# Altium project LimeSDR-X3_1v2.PrjPcb (part 10 of 20)

## Sheet 19_FPGA_misc.SchDoc: FPGA misc (PCIe, config)
size A3; Organization: Lime Microsystems; Address1: Surrey Tech Centre; Address2: Guildford GU2 7YG; Address3: Surrey; Address4: United Kingdom; Revision: 1.2; SheetNumber: 19; SheetTotal: 31
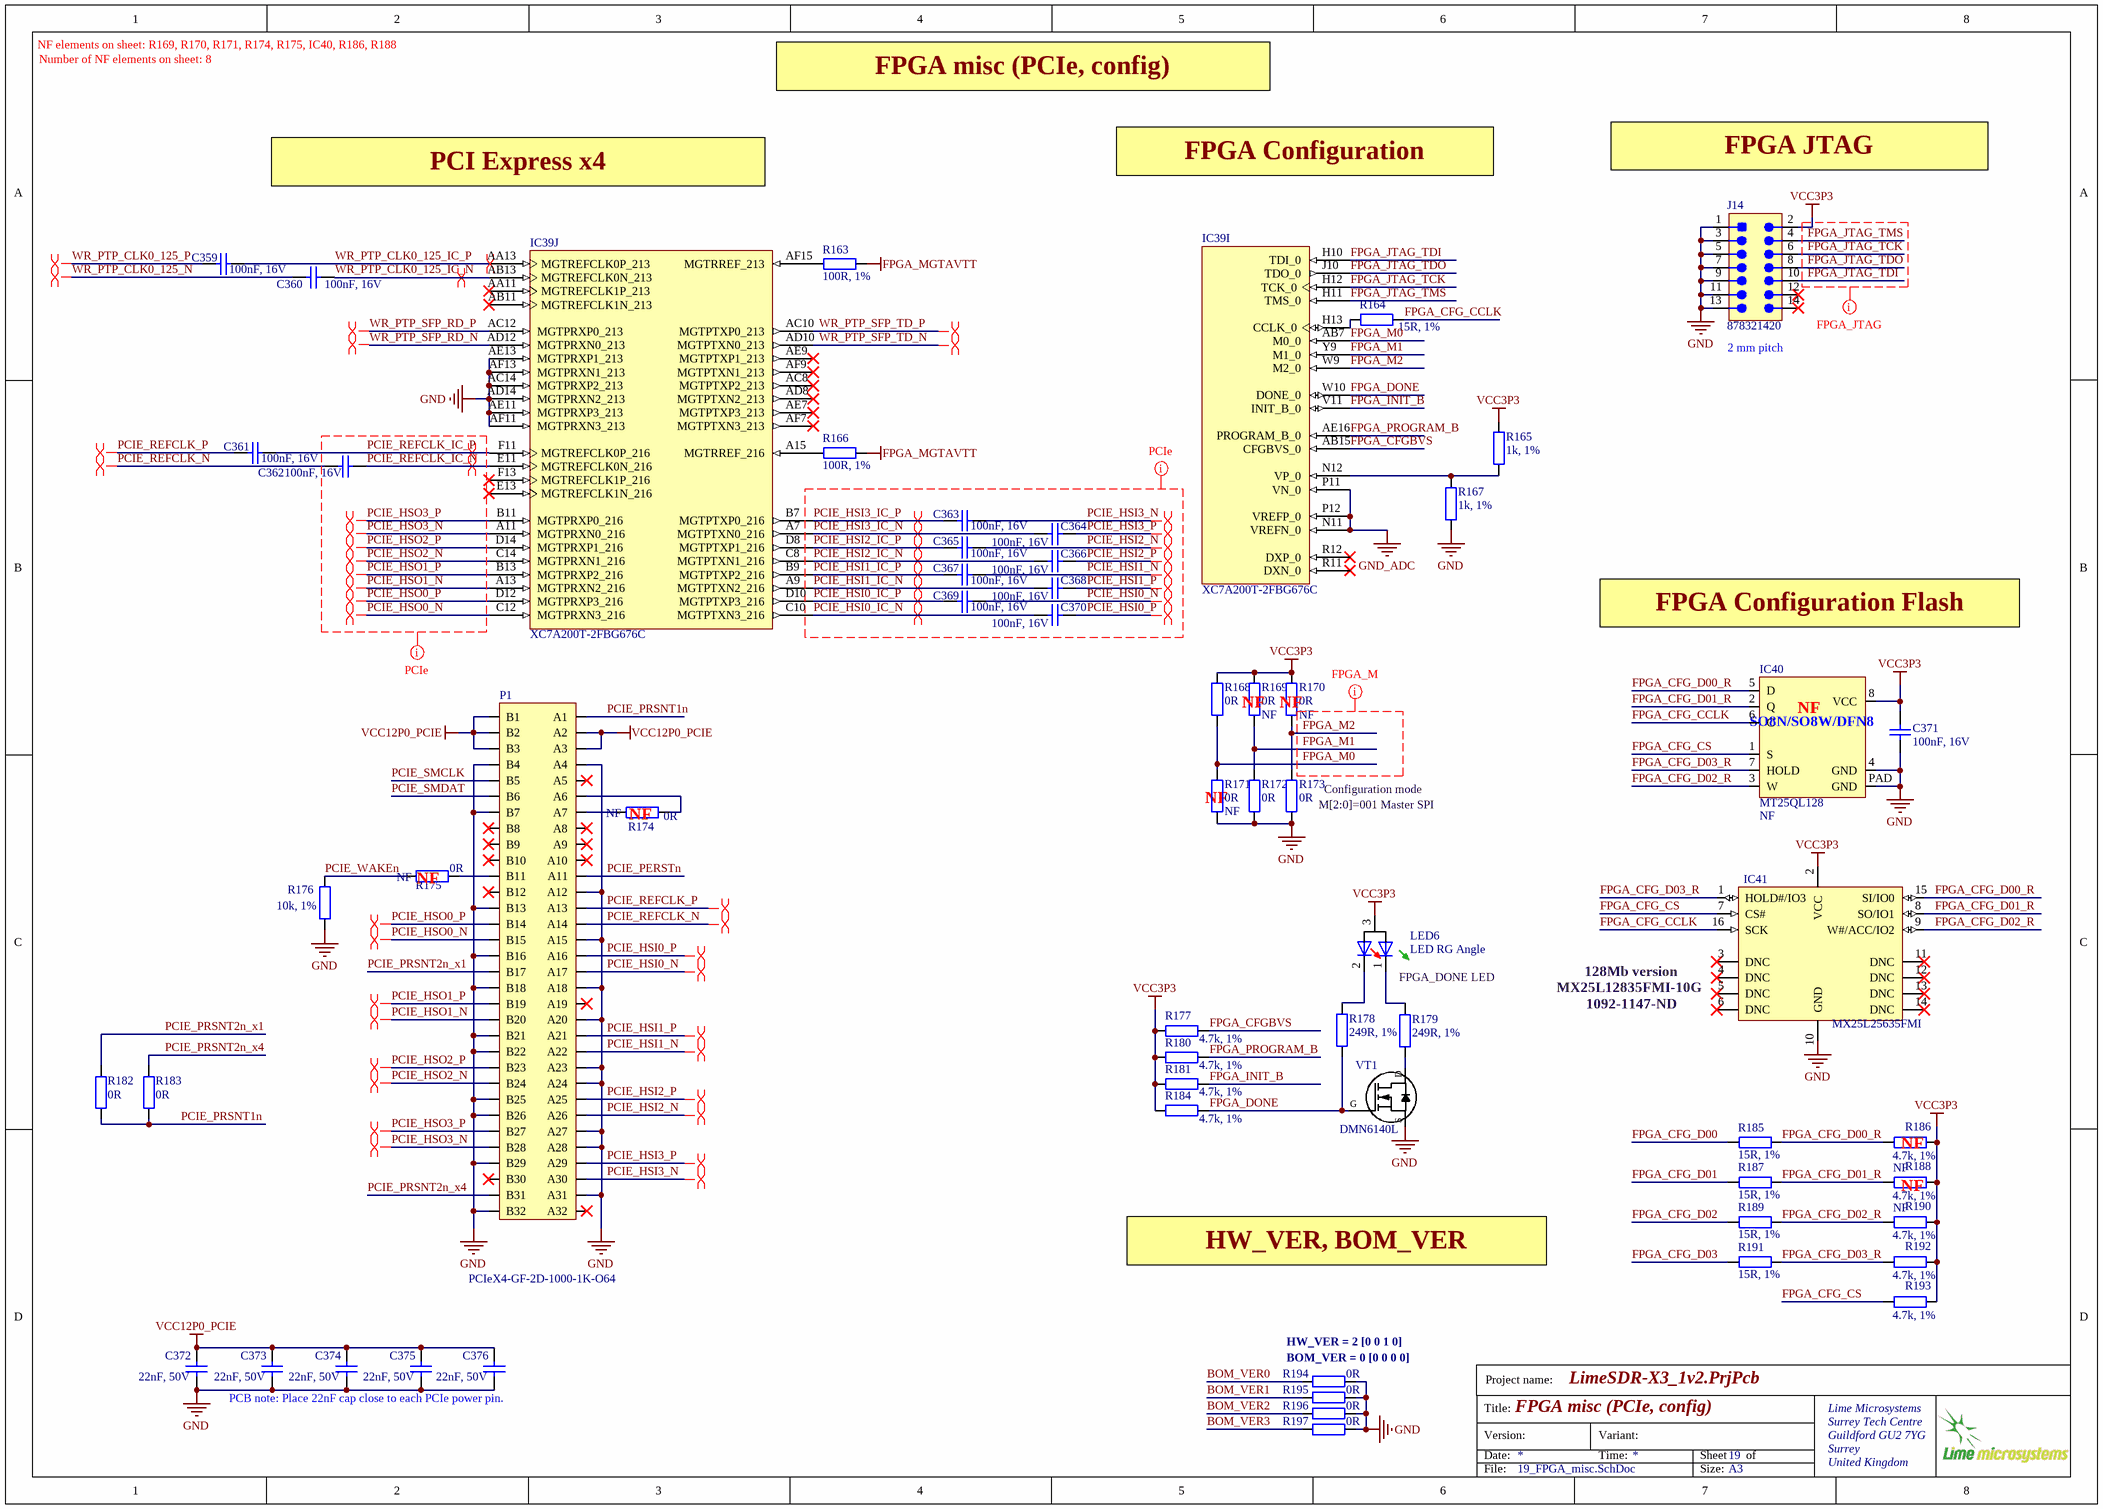
[diagram p18: 19_FPGA_misc.SchDoc]

### Parts
C359  100nF, 16V  [CAP0402]
C360  100nF, 16V  [CAP0402]
C361  100nF, 16V  [CAP0402]
C362  100nF, 16V  [CAP0402]
C363  100nF, 16V  [CAP0402]
C364  100nF, 16V  [CAP0402]
C365  100nF, 16V  [CAP0402]
C366  100nF, 16V  [CAP0402]
C367  100nF, 16V  [CAP0402]
C368  100nF, 16V  [CAP0402]
C369  100nF, 16V  [CAP0402]
C370  100nF, 16V  [CAP0402]
C371  100nF, 16V  [CAP0402]
C372  22nF, 50V  [CAP0402]
C373  22nF, 50V  [CAP0402]
C374  22nF, 50V  [CAP0402]
C375  22nF, 50V  [CAP0402]
C376  22nF, 50V  [CAP0402]
IC39  XC7A200T-2FBG676C  [XC7A200T-2FBG676C_FBG676]  (parts I,J of 14)
IC40  MT25QL128  Assembly Info: NF  [S25FL164K_WSON8_DFN6]
IC41  MX25L25635FMI  [SOIC16_WIDE]
J14  878321420  [MOLEX-878321420_V]
LED6  LED RG Angle  [LED_RG_RIGHT_ANGLE_v3]
P1  PCIeX4-GF-2D-1000-1K-O64  [PCIeX4-GF-2D-1000-1K-O64]  (no BOM)
R163  100R, 1%  [RES0402]
R164  15R, 1%  [RES0402]
R165  1k, 1%  [RES0402]
R166  100R, 1%  [RES0402]
R167  1k, 1%  [RES0402]
R168  0R  [RES0402]
R169  0R  Assembly Info: NF  [RES0402]
R170  0R  Assembly Info: NF  [RES0402]
R171  0R  Assembly Info: NF  [RES0402]
R172  0R  [RES0402]
R173  0R  [RES0402]
R174  0R  Assembly Info: NF  [RES0402]
R175  0R  Assembly Info: NF  [RES0402]
R176  10k, 1%  [RES0402]
R177  4.7k, 1%  [RES0402]
R178  249R, 1%  [RES0402]
R179  249R, 1%  [RES0402]
R180  4.7k, 1%  [RES0402]
R181  4.7k, 1%  [RES0402]
R182  0R  [RES0402]
R183  0R  [RES0402]
R184  4.7k, 1%  [RES0402]
R185  15R, 1%  [RES0402]
R186  4.7k, 1%  Assembly Info: NF  [RES0402]
R187  15R, 1%  [RES0402]
R188  4.7k, 1%  Assembly Info: NF  [RES0402]
R189  15R, 1%  [RES0402]
R190  4.7k, 1%  [RES0402]
R191  15R, 1%  [RES0402]
R192  4.7k, 1%  [RES0402]
R193  4.7k, 1%  [RES0402]
R194  0R  [RES0402]
R195  0R  [RES0402]
R196  0R  [RES0402]
R197  0R  [RES0402]
VT1  DMN6140L  [SOT23-3]

### Nets
FPGA_MGTAVTT: R163.2 R166.2
GND: C371.2 C372.2 C373.2 C374.2 C375.2 C376.2 IC39.AC14(MGTPRXP2_213) IC39.AD14(MGTPRXN2_213) IC39.AE11(MGTPRXP3_213) IC39.AE13(MGTPRXP1_213) IC39.AF11(MGTPRXN3_213) IC39.AF13(MGTPRXN1_213) IC40.4(GND) IC40.PAD(GND) IC41.10(GND) J14.1 J14.3 J14.5 J14.7 J14.9 J14.11 J14.13 P1.A4 P1.A12 P1.A15 P1.A18 P1.A20 P1.A23 P1.A24 P1.A27 P1.A28 P1.A31 P1.B4 P1.B7 P1.B13 P1.B16 P1.B18 P1.B21 P1.B22 P1.B25 P1.B26 P1.B29 P1.B32 R167.1 R171.2 R172.2 R173.2 R176.2 R194.2 R195.2 R196.2 R197.2 VT1.S
GND_ADC: IC39.N11(VREFN_0) IC39.P11(VN_0) IC39.P12(VREFP_0)
VCC3P3: C371.1 IC40.8(VCC) IC41.2(VCC) J14.2 LED6.3(A) R165.1 R168.1 R169.1 R170.1 R177.1 R180.1 R181.1 R184.1 R186.1 R188.1 R190.1 R192.1 R193.1
VCC12P0_PCIE: C372.1 C373.1 C374.1 C375.1 C376.1 P1.A2 P1.A3 P1.B1 P1.B2 P1.B3
BOM_VER0: R194.1
BOM_VER1: R195.1
BOM_VER2: R196.1
BOM_VER3: R197.1
FPGA_CFG_CCLK: IC40.6(C) IC41.16(SCK) R164.2
FPGA_CFG_CS: IC40.1(S) IC41.7(CS#) R193.2
FPGA_CFG_D00: R185.2
FPGA_CFG_D00_R: IC40.5(D) IC41.15(SI/IO0) R185.1 R186.2
FPGA_CFG_D01: R187.2
FPGA_CFG_D01_R: IC40.2(Q) IC41.8(SO/IO1) R187.1 R188.2
FPGA_CFG_D02: R189.2
FPGA_CFG_D02_R: IC40.3(W) IC41.9(W#/ACC/IO2) R189.1 R190.2
FPGA_CFG_D03: R191.2
FPGA_CFG_D03_R: IC40.7(HOLD) IC41.1(HOLD#/IO3) R191.1 R192.2
FPGA_CFGBVS: IC39.AB15(CFGBVS_0) R177.2
FPGA_DONE: IC39.W10(DONE_0) R178.1 R184.2 VT1.G
FPGA_INIT_B: IC39.V11(INIT_B_0) R181.2
FPGA_JTAG_TCK: IC39.H12(TCK_0) J14.6
FPGA_JTAG_TDI: IC39.H10(TDI_0) J14.10
FPGA_JTAG_TDO: IC39.J10(TDO_0) J14.8
FPGA_JTAG_TMS: IC39.H11(TMS_0) J14.4
FPGA_M0: IC39.AB7(M0_0) R168.2 R171.1
FPGA_M1: IC39.Y9(M1_0) R169.2 R172.1
FPGA_M2: IC39.W9(M2_0) R170.2 R173.1
FPGA_PROGRAM_B: IC39.AE16(PROGRAM_B_0) R180.2
PCIE_HSI0_IC_N: C370.2 IC39.C10(MGTPTXN3_216)
PCIE_HSI0_IC_P: C369.2 IC39.D10(MGTPTXP3_216)
PCIE_HSI0_N: C369.1 P1.A17
PCIE_HSI0_P: C370.1 P1.A16
PCIE_HSI1_IC_N: C368.2 IC39.A9(MGTPTXN2_216)
PCIE_HSI1_IC_P: C367.2 IC39.B9(MGTPTXP2_216)
PCIE_HSI1_N: C367.1 P1.A22
PCIE_HSI1_P: C368.1 P1.A21
PCIE_HSI2_IC_N: C366.2 IC39.C8(MGTPTXN1_216)
PCIE_HSI2_IC_P: C365.2 IC39.D8(MGTPTXP1_216)
PCIE_HSI2_N: C365.1 P1.A26
PCIE_HSI2_P: C366.1 P1.A25
PCIE_HSI3_IC_N: C364.2 IC39.A7(MGTPTXN0_216)
PCIE_HSI3_IC_P: C363.2 IC39.B7(MGTPTXP0_216)
PCIE_HSI3_N: C363.1 P1.A30
PCIE_HSI3_P: C364.1 P1.A29
PCIE_HSO0_N: IC39.C12(MGTPRXN3_216) P1.B15
PCIE_HSO0_P: IC39.D12(MGTPRXP3_216) P1.B14
PCIE_HSO1_N: IC39.A13(MGTPRXN2_216) P1.B20
PCIE_HSO1_P: IC39.B13(MGTPRXP2_216) P1.B19
PCIE_HSO2_N: IC39.C14(MGTPRXN1_216) P1.B24
PCIE_HSO2_P: IC39.D14(MGTPRXP1_216) P1.B23
PCIE_HSO3_N: IC39.A11(MGTPRXN0_216) P1.B28
PCIE_HSO3_P: IC39.B11(MGTPRXP0_216) P1.B27
PCIE_PERSTn: P1.A11
PCIE_PRSNT1n: P1.A1 R182.1 R183.1
PCIE_PRSNT2n_x1: P1.B17 R182.2
PCIE_PRSNT2n_x4: P1.B31 R183.2
PCIE_REFCLK_IC_N: C362.1 IC39.E11(MGTREFCLK0N_216)
PCIE_REFCLK_IC_P: C361.1 IC39.F11(MGTREFCLK0P_216)
PCIE_REFCLK_N: C362.2 P1.A14
PCIE_REFCLK_P: C361.2 P1.A13
PCIE_SMCLK: P1.B5
PCIE_SMDAT: P1.B6
PCIE_WAKEn: R175.1 R176.1
WR_PTP_CLK0_125_IC_N: C360.1 IC39.AB13(MGTREFCLK0N_213)
WR_PTP_CLK0_125_IC_P: C359.1 IC39.AA13(MGTREFCLK0P_213)
WR_PTP_CLK0_125_N: C360.2
WR_PTP_CLK0_125_P: C359.2
WR_PTP_SFP_RD_N: IC39.AD12(MGTPRXN0_213)
WR_PTP_SFP_RD_P: IC39.AC12(MGTPRXP0_213)
WR_PTP_SFP_TD_N: IC39.AD10(MGTPTXN0_213)
WR_PTP_SFP_TD_P: IC39.AC10(MGTPTXP0_213)
NetIC39_A15: IC39.A15(MGTRREF_216) R166.1
NetIC39_AF15: IC39.AF15(MGTRREF_213) R163.1
NetIC39_H13: IC39.H13(CCLK_0) R164.1
NetIC39_N12: IC39.N12(VP_0) R165.2 R167.2
NetLED6_1: LED6.1(C1) R179.2
NetLED6_2: LED6.2(C2) R178.2
NetP1_A6: P1.A6 R174.2
NetP1_A7: P1.A7 R174.1
NetP1_B11: P1.B11 R175.2
NetR179_1: R179.1 VT1.D

Not connected (* = marked no-connect by the designer): IC39 AA11(MGTREFCLK1P_213)* AB11(MGTREFCLK1N_213)* AC8(MGTPTXP2_213)* AD8(MGTPTXN2_213)* AE7(MGTPTXP3_213)* AE9(MGTPTXP1_213)* AF7(MGTPTXN3_213)* AF9(MGTPTXN1_213)* E13(MGTREFCLK1N_216)* F13(MGTREFCLK1P_216)* R11(DXN_0)* R12(DXP_0)*; IC41 3(DNC)* 4(DNC)* 5(DNC)* 6(DNC)* 11(DNC)* 12(DNC)* 13(DNC)* 14(DNC)*; J14 12* 14*; P1 A5* A8* A9* A10* A19* A32* B8* B9* B10* B12* B30*

### Layout directives
differential pair: PCIE_HSI0_IC_N, PCIE_HSI0_IC_P, PCIE_HSI0_N, PCIE_HSI0_P, PCIE_HSI1_IC_N, PCIE_HSI1_IC_P, PCIE_HSI1_N, PCIE_HSI1_P, PCIE_HSI2_IC_N, PCIE_HSI2_IC_P, PCIE_HSI2_N, PCIE_HSI2_P, PCIE_HSI3_IC_N, PCIE_HSI3_IC_P, PCIE_HSI3_N, PCIE_HSI3_P, PCIE_HSO0_N, PCIE_HSO0_P, PCIE_HSO1_N, PCIE_HSO1_P, PCIE_HSO2_N, PCIE_HSO2_P, PCIE_HSO3_N, PCIE_HSO3_P, PCIE_REFCLK_IC_N, PCIE_REFCLK_IC_P, PCIE_REFCLK_N, PCIE_REFCLK_P, WR_PTP_CLK0_125_IC_N, WR_PTP_CLK0_125_IC_P, WR_PTP_CLK0_125_N, WR_PTP_CLK0_125_P, WR_PTP_SFP_RD_N, WR_PTP_SFP_RD_P, WR_PTP_SFP_TD_N, WR_PTP_SFP_TD_P
net class FPGA_JTAG: FPGA_JTAG_TCK, FPGA_JTAG_TDI, FPGA_JTAG_TDO, FPGA_JTAG_TMS
net class FPGA_M: FPGA_M0, FPGA_M1, FPGA_M2
net class PCIe: PCIE_HSI0_IC_N, PCIE_HSI0_IC_P, PCIE_HSI0_N, PCIE_HSI0_P, PCIE_HSI1_IC_N, PCIE_HSI1_IC_P, PCIE_HSI1_N, PCIE_HSI1_P, PCIE_HSI2_IC_N, PCIE_HSI2_IC_P, PCIE_HSI2_N, PCIE_HSI2_P, PCIE_HSI3_IC_N, PCIE_HSI3_IC_P, PCIE_HSI3_N, PCIE_HSI3_P, PCIE_HSO0_N, PCIE_HSO0_P, PCIE_HSO1_N, PCIE_HSO1_P, PCIE_HSO2_N, PCIE_HSO2_P, PCIE_HSO3_N, PCIE_HSO3_P, PCIE_REFCLK_IC_N, PCIE_REFCLK_IC_P

### Notes on the sheet
- NF elements on sheet: R169, R170, R171, R174, R175, IC40, R186, R188
- Number of NF elements on sheet: 8
- FPGA misc (PCIe, config)
- PCI Express x4
- FPGA Configuration
- FPGA JTAG
- (near J14) 2 mm pitch
- FPGA Configuration Flash
- (near R169) NF
- (near R170) NF
- (near IC40) NF
- (near R174) NF
- (near R171) NF
- (near R173) M[2:0]=001 Master SPI
- (near R173) Configuration mode
- (near R175) NF
- FPGA_DONE LED
- (near IC41) 128Mb version
  MX25L12835FMI-10G
  1092-1147-ND
- (near R186) NF
- (near R188) NF
- HW_VER, BOM_VER
- (near R194) BOM_VER = 0 [0 0 0 0]
- HW_VER = 2 [0 0 1 0]
- PCB note: Place 22nF cap close to each PCIe power pin.
- Project name:
- Title:
- Version:
- Date:
- Variant:
- Time:
- Sheet
- of
- File:
- Size:
- A3
- (in symbol M25P40_with_pad) SO8N/SO8W/DFN8

### Library data of the parts
C359-C370 = Cap_0603: Part Description: 0.10µF ±10% 16V X7R Ceramic Capacitor -55°C ~ 125°C Surface Mount, MLCC 0402 (1005 Metric) 0.039" L x 0.020" W (1.00mm x 0.50mm); Manufacturer Part Number 1: GRM155R71C104KA88D; Brand: Murata Electronics; Tolerance: 10 %; Type: General Purpose MLCC; Capacitance: 0.1 uF; Temperature Coefficient / Code: +/- 15 %; Case Height: 0.5 mm; Case Length: 1 mm; Dielectric: X7R; Supplier 1: Mouser; Supplier Part Number 1: 81-GRM155R71C104KA88; Case Code - in: 0402; Manufacturer: Murata Electronics; Category: Multilayer Ceramic Capacitors MLCC - SMD/SMT; Voltage Rating DC: 16 V; Value: 100nF, 16V; Case Code - mm: 1005; Case Width: 0.5 mm; Maximum Operating Temperature: + 125 C; Minimum Operating Temperature: - 55 C; Minimum Order Quantity: 1; Operating Temperature Range: - 55 C to + 125 C; Package / Case: 0402 (1005 metric); Packaging: Reel; Product: General Type MLCCs; Product Category: Low & Medium Capacitance SMD Ceramic Chip Capacitors; Reeling: True; RoHS - Mouser: Y; RoHS: RoHS Compliant; Series: GRM; Standard Pack Qty: 10000; Termination Style: SMD/SMT
C371 = Cap_0603: Manufacturer Part Number 1: GRM155R71C104KA88D; Part Description: 0.10µF ±10% 16V X7R Ceramic Capacitor -55°C ~ 125°C Surface Mount, MLCC 0402 (1005 Metric) 0.039" L x 0.020" W (1.00mm x 0.50mm); Brand: Murata Electronics; Tolerance: 10 %; Type: General Purpose MLCC; Capacitance: 0.1 uF; Temperature Coefficient / Code: +/- 15 %; Case Height: 0.5 mm; Case Length: 1 mm; Dielectric: X7R; Supplier 1: Mouser; Supplier Part Number 1: 81-GRM155R71C104KA88; Case Code - in: 0402; Manufacturer: Murata Electronics; Category: Multilayer Ceramic Capacitors MLCC - SMD/SMT; Voltage Rating DC: 16 V; Value: 100nF, 16V; Case Code - mm: 1005; Case Width: 0.5 mm; Maximum Operating Temperature: + 125 C; Minimum Operating Temperature: - 55 C; Minimum Order Quantity: 1; Operating Temperature Range: - 55 C to + 125 C; Package / Case: 0402 (1005 metric); Packaging: Reel; Product: General Type MLCCs; Product Category: Low & Medium Capacitance SMD Ceramic Chip Capacitors; Reeling: True; RoHS - Mouser: Y; RoHS: RoHS Compliant; Series: GRM; Standard Pack Qty: 10000; Termination Style: SMD/SMT
C372-C376 = Cap_0402: Manufacturer: Kemet; Manufacturer Part Number 1: C0402C223K5RACTU; Part Description: 0.022µF ±10% 50V Ceramic Capacitor X7R 0402 (1005 Metric); Temperature Coefficient: X7R; Tolerance: ±10%; Capacitance: 0.022µF; Value: 22nF, 50V; Supplier 1: Digi-Key; Supplier Part Number 1: 399-7780-1-ND; Ratings: -; Packaging: Cut Tape (CT); Category: Capacitors; Size / Dimension: 0.039" L x 0.020" W (1.00mm x 0.50mm); RoHS: RoHS Compliant; Operating Temperature: -55°C ~ 125°C; Mounting Type: Surface Mount, MLCC; Applications: General Purpose; Voltage - Rated: 50V; Thickness (Max): 0.022" (0.55mm); Features: -; Height - Seated (Max): -; Lead Style: -; Package / Case: 0402 (1005 Metric); Lead Spacing: -
IC39 = XC7A200T-2FBG676C: Artix-7 FPGA, 400 User I/Os, 8 GTP, 676-Ball BGA, Speed Grade 2, Commercial Grade, Pb-Free; Manufacturer: Xilinx; Part Description: IC FPGA 400 I/O 676FCBGA; Speed Grade: -2; Number of Logic Blocks (LABs): 16825; Number of Logic Elements/Cells: 215360; RAM Size: 13455360b; Number of I/Os: 400; Number of Registers: 269200; Memory Type: DDR3; Memory Size: 1GB; Max Supply Voltage: 1.05V; Min Supply Voltage: 950mV; ComponentLink1Description: Manufacturer URL; ComponentLink1URL: http://www.xilinx.com/; ComponentLink2Description: Datasheet; ComponentLink2URL: http://www.xilinx.com/support/documentation/data_sheets/ds180_7Series_Overview.pdf; ComponentLink3Description: Package Specification; ComponentLink3URL: http://www.xilinx.com/support/documentation/user_guides/ug475_7Series_Pkg_Pinout.pdf; ComponentLink4Description: DC and Switching Characteristics; ComponentLink4URL: http://www.xilinx.com/support/documentation/data_sheets/ds181_Artix_7_Data_Sheet.pdf; ComponentLink5Description: Package File; ComponentLink5URL: http://www.xilinx.com/support/packagefiles/a7packages/xc7a200tfbg676pkg.txt; ComponentLink6Description: Packaging and Pinout; ComponentLink6URL: http://www.xilinx.com/support/documentation/user_guides/ug475_7Series_Pkg_Pinout.pdf; Supplier 1: Digi-Key; Supplier Part Number 1: 122-1865-ND; Manufacturer Part Number 1: XC7A200T-2FBG676C; Stock 1: 124; Pricing 1: 1=261,30000 (USD); RoHS: Yes; Case/Package: FCBGA; Number of Pins: 676; Contact Plating: Copper,Tin,Silver; Min Operating Temperature: 0°C; Max Operating Temperature: 85°C; ComponentLink7URL: https://datasheet.ciiva.com/15066/ds181-artix-7-data-sheet-15066344.pdf?src-supplier=Digi-Key; ComponentLink7Description: https://datasheet.ciiva.com/15066/ds181-artix-7-data-sheet-15066344.pdf?src-supplier=Digi-Key; ComponentLink8URL: https://datasheet.ciiva.com/48475/ds180-7series-overview-48475947.pdf?src-supplier=Avnet; ComponentLink8Description: https://datasheet.ciiva.com/48475/ds180-7series-overview-48475947.pdf?src-supplier=Avnet
IC40 = M25P40_with_pad: Manufacturer: Micron Technology; Manufacturer Part Number 1: MT25QL128ABA1ESE-0SITTR; Part Description: FLASH - NOR Memory IC 128Mb (16M x 8) SPI 133MHz  8-SO; Frequency: 133MHz; Memory Size: 128Mb; Memory Type: Non-Volatile,FLASH; Case/Package: SOIC; Max Operating Temperature: 85°C; Min Operating Temperature: -40°C; Mount: Surface Mount; Number of Pins: 8; Packaging: Tape and Reel; Pricing 1: 1=2.67, 10=2.401, 25=2.3632, 50=2.357, 100=2.1061, 250=2.03764, 500=2.03006 (USD); Stock 1: 4313; Supplier 1: Digi-Key; Supplier Part Number 1: 557-1772-1-ND; Value: MT25QL128
IC41 = S25FL032P: Manufacturer: Macronix; Manufacturer Part Number 1: MX25L25635FMI-10G; Part Description: FLASH - NOR Memory IC 256Mb (32M x 8) SPI 104MHz  16-SOP; Operating Supply Voltage: 3.6V; Interface: SPI,Serial; Memory Type: FLASH,NOR; Frequency: 104MHz; Density: 256Mb; Supplier 1: Digi-Key; Supplier Part Number 1: 1092-1149-ND; Stock 1: 19945; Pricing 1: 1=4.09, 528=3.11068 (USD); Case/Package: SOIC; Number of Pins: 16; Min Operating Temperature: -40°C; Max Operating Temperature: 85°C; Package Quantity: 44; Packaging: Rail/Tube; Max Frequency: 104MHz; Lead Free: Lead Free; Value: MX25L25635FMI
J14 = MOLEX_CONNECTOR_0878321420: Male Header, Pitch 2 mm, 2 x 7 Position, Height 7.6 mm, -55 to 105 degC, RoHS; Part Description: Connector Header Surface Mount 14 position 0.079" (2.00mm); Manufacturer: Molex; Manufacturer Part Number 1: 87832-1420; Number of Positions: 14; Current Rating: 2A; Insulation Resistance: 1GR; Voltage Rating: 125V; Shrouded: Yes (With); Pitch: 2mm; Glow Wire Compliant: Non-compliant; Supplier 1: Digi-Key; Stock 1: 62479; Pricing 1: 1 = 1,83000, 10 = 1,66000, 100 = 1,42280, 500 = 1,18562, 3200 = 0,94850, 6400 = 0,90108 (USD); RoHS: Yes; Mount: Surface Mount; Color: Black; Housing Color: Black; Housing Material: Thermoplastic; Contact Plating: Gold; Contact Material: Brass; Min Operating Temperature: -55°C; Max Operating Temperature: 105°C; Number of Rows: 2; Packaging: Rail/Tube; Termination: SMD/SMT; Number of Contacts: 14; Orientation: Vertical; Gender: Male; Package Quantity: 3200; Number of Circuits: 14; Voltage Rating (DC): 125V; Radiation Hardening: No; REACH SVHC: No SVHC; Lead Free: Lead Free; Flammability Rating: UL94 V-0; ComponentLink1URL: https://datasheet.ciiva.com/5151/0878321420-pcb-headers-176595-5151942.pdf?src-supplier=Mouser; ComponentLink1Description: https://datasheet.ciiva.com/5151/0878321420-pcb-headers-176595-5151942.pdf?src-supplier=Mouser; ComponentLink2URL: https://datasheet.ciiva.com/30118/0878321420-pcb-headers-30118102.pdf?src-supplier=Onlinecomponents.com; ComponentLink2Description: https://datasheet.ciiva.com/30118/0878321420-pcb-headers-30118102.pdf?src-supplier=Onlinecomponents.com; ComponentLink3URL: https://datasheet.ciiva.com/11746/0900766b80d68d6a-11746394.pdf?src-supplier=RSComponents; ComponentLink3Description: https://datasheet.ciiva.com/11746/0900766b80d68d6a-11746394.pdf?src-supplier=RSComponents; ComponentLink4URL: https://datasheet.ciiva.com/7814/1625645-7814923.pdf?src-supplier=Element14; ComponentLink4Description: https://datasheet.ciiva.com/7814/1625645-7814923.pdf?src-supplier=Element14; ComponentLink5URL: https://datasheet.ciiva.com/27055/1934622-27055085.pdf?src-supplier=Jameco; ComponentLink5Description: https://datasheet.ciiva.com/27055/1934622-27055085.pdf?src-supplier=Jameco; ComponentLink6URL: https://datasheet.ciiva.com/1103/1739253-1103569.pdf?src-supplier=Element14; ComponentLink6Description: https://datasheet.ciiva.com/1103/1739253-1103569.pdf?src-supplier=Element14; ComponentLink7URL: https://datasheet.ciiva.com/18453/70090647-18453733.pdf?src-supplier=Allied+Electronics; ComponentLink7Description: https://datasheet.ciiva.com/18453/70090647-18453733.pdf?src-supplier=Allied+Electronics; ComponentLink8URL: https://datasheet.ciiva.com/6168/1597333-6168907.pdf?src-supplier=Farnell; ComponentLink8Description: https://datasheet.ciiva.com/6168/1597333-6168907.pdf?src-supplier=Farnell; Supplier Part Number 1: WM18641-ND
LED6 = LED_green_red_right_angle_v2: Part Description: Green, Red 572nm Green, 647nm Red LED Indication - Discrete 2.1V Green, 1.7V Red 2-SMD, No Lead; Manufacturer: Stanley Electric; Manufacturer Part Number 1: BRPY1211FTR; Color: Green,Red; Lens Color: White; Viewing Angle: 143°; Forward Voltage: 1.7V; Lens Style: Colorless; Wavelength: 570nm; Reverse Breakdown Voltage: 4V; Forward Current: 25mA; Dominant Wavelength: 647nm; Luminous Intensity: 17.6mcd; Test Current: 20mA; Lens Transparency: Diffused; Number of Elements: 2; Power Dissipation: 70mW; Supplier 1: Arrow Electronics; Supplier Part Number 1: BRPY1211F-TR; Stock 1: 0; RoHS: Yes; Mount: Surface Mount; Case/Package: SMD/SMT; Number of Pins: 3; Min Operating Temperature: -40°C; Max Operating Temperature: 85°C; Packaging: Tape and Reel; Package Quantity: 3000; Reverse Voltage: 4V; Length: 3mm; Width: 2mm; Height: 1.15mm; Depth: 2mm; Radiation Hardening: No; Lead Free: Lead Free; ComponentLink1URL: https://datasheet.ciiva.com/2114/1211f-e-2114386.pdf?src-supplier=Digi-Key; ComponentLink1Description: https://datasheet.ciiva.com/2114/1211f-e-2114386.pdf?src-supplier=Digi-Key
R163 R166 = Res_0402: Manufacturer Part Number 1: RMCF0402FT100R; Part Description: RES SMD 100 OHM 1% 1/16W 0402; Manufacturer: Stackpole Electronics Inc.; Temperature Coefficient: ±100ppm/°C; Supplier 1: Digi-Key; Supplier Part Number 1: RMCF0402FT100RDKR-ND; Package / Case: 0402 (1005 Metric); Composition: Thick Film; Category: Resistors; Tolerance: ±1%; Value: 100R, 1%
R164 = Res_0402: Manufacturer: Yageo; Manufacturer Part Number 1: RC0402FR-0715RL; Part Description: 15 Ohms ±1% 0.063W, 1/16W Chip Resistor 0402 (1005 Metric) Moisture Resistant Thick Film; Max Power Dissipation: 63mW; Temperature Coefficient: 100ppm/°C; Voltage Rating: 50V; ComponentLink1URL: http://www.farnell.com/datasheets/1018594.pdf?src-supplier=Element14; ComponentLink1Description: http://www.farnell.com/datasheets/1018594.pdf?src-supplier=Element14; ComponentLink2URL: https://www.verical.com/server-webapp/html/getDatasheet?partID=323697&src-supplier=Verical; ComponentLink2Description: https://www.verical.com/server-webapp/html/getDatasheet?partID=323697&src-supplier=Verical; Value: 15R, 1%; Case/Package: 0402; Case Code (Imperial): 0402; Case Code (Metric): 1005; ComponentLink3Description: http://www.yageo.com/documents/recent/PYu-RC0402_51_RoHS_L_6_r.pdf?src-supplier=Future+Electronics; ComponentLink3URL: http://www.yageo.com/documents/recent/PYu-RC0402_51_RoHS_L_6_r.pdf?src-supplier=Future+Electronics; ComponentLink4Description: http://www.yageo.com/documents/recent/PYu-RC0402_51_RoHS_L_6_r.pdf?src-supplier=Mouser; ComponentLink4URL: http://www.yageo.com/documents/recent/PYu-RC0402_51_RoHS_L_6_r.pdf?src-supplier=Mouser; Composition: Thick Film; Depth: 0.5mm; Features: Moisture Resistant; Height: 0.016inch; Lead Free: Lead Free; Length: 1mm; Max Operating Temperature: 155°C; Military Standard: Not; Min Operating Temperature: -55°C; Number of Terminations: 2; Package Quantity: 1; Packaging: Tape and Reel; Power Rating: 63mW; Pricing 1: 1=0.1, 10=0.016, 100=0.0067, 1000=0.00301, 2500=0.00261, 5000=0.00215 (USD); REACH SVHC: Unknown; Resistance: 15R; Stock 1: 1902799; Supplier 1: Digi-Key; Supplier Part Number 1: 311-15LRCT-ND; Termination: SMD/SMT; Tolerance: 1%; Width: 0.02inch
R165 R167 = Res_0402: Manufacturer: Stackpole Electronics Inc; Manufacturer Part Number 1: RMCF0402FT1K00; Part Description: RES SMD 1K OHM 1% 1/16W 0402; Temperature Coefficient: ±100ppm/°C; Power (Watts): 0.063W, 1/16W; Value: 1k, 1%; Supplier 1: Digi-Key; Supplier Part Number 1: RMCF0402FT1K00TR-ND; Resistance (Ohms): 1k; Packaging: Tape & Reel (TR); Category: Resistors; RoHS: RoHS Compliant; Tolerance: ±1%; Height: 0.016" (0.40mm); Number of Terminations: 2; Package / Case: 0402 (1005 Metric); Operating Temperature: -55°C ~ 155°C; Features: -; Composition: Thick Film; Supplier Device Package: 0402; Size / Dimension: 0.039" L x 0.020" W (1.00mm x 0.50mm)
R168-R173 = Res_0402: Manufacturer Part Number 1: RC0402JR-070RL; Manufacturer: Yageo; Part Description: RES SMD 0.0OHM JUMPER 1/16W 0402; Resistance (Ohms): 0.0; Tolerance: Jumper; Power (Watts): 0.063W, 1/16W; Value: 0R; Supplier 1: Digi-Key; Supplier Part Number 1: 311-0.0JRTR-ND; Category: Resistors; Temperature Coefficient: -; Features: Moisture Resistant; Supplier Device Package: 0402; Height: 0.016" (0.40mm); Package / Case: 0402 (1005 Metric); Operating Temperature: -55°C ~ 155°C; Size / Dimension: 0.039" L x 0.020" W (1.00mm x 0.50mm); Composition: Thick Film; Packaging: Tape & Reel (TR); Number of Terminations: 2; RoHS: RoHS Compliant
R174 R175 R182 R183 R194-R197 = Res_0402: Manufacturer: Yageo; Part Description: RES SMD 0.0OHM JUMPER 1/16W 0402; Manufacturer Part Number 1: RC0402JR-070RL; Supplier 1: Digi-Key; Supplier Part Number 1: 311-0.0JRTR-ND; Composition: Thick Film; Package / Case: 0402 (1005 Metric); Category: Resistors; Value: 0R
R176 = Res_0402: Manufacturer: Yageo; Manufacturer Part Number 1: RC0402FR-0710KL; Part Description: RES SMD 10K OHM 1% 1/16W 0402; Temperature Coefficient: ±100ppm/°C; Power (Watts): 0.063W, 1/16W; Value: 10k, 1%; Supplier 1: Digi-Key; Supplier Part Number 1: 311-10.0KLRTR-ND; Resistance (Ohms): 10k; Packaging: Tape & Reel (TR); RoHS: RoHS Compliant; Package / Case: 0402 (1005 Metric); Tolerance: ±1%; Operating Temperature: -55°C ~ 155°C; Size / Dimension: 0.039" L x 0.020" W (1.00mm x 0.50mm); Number of Terminations: 2; Category: Resistors; Height: 0.016" (0.40mm); Supplier Device Package: 0402; Features: Moisture Resistant; Composition: Thick Film
R177 R180 R181 R184 R186 R188 R190 R192 R193 = Res_0402: Manufacturer: Yageo; Part Description: RES SMD 4.7K OHM 1% 1/16W 0402; Manufacturer Part Number 1: RC0402FR-074K7L; Temperature Coefficient: ±100ppm/°C; Power (Watts): 0.063W, 1/16W; Number of Terminations: 2; Category: Resistors; Supplier 1: Digi-Key; Height: 0.016" (0.40mm); Features: Moisture Resistant; Size / Dimension: 0.039" L x 0.020" W (1.00mm x 0.50mm); Supplier Device Package: 0402; RoHS: RoHS Compliant; Composition: Thick Film; Package / Case: 0402 (1005 Metric); Resistance (Ohms): 4.7k; Operating Temperature: -55°C ~ 155°C; Tolerance: ±1%; Supplier Part Number 1: 311-4.7KLRCT-ND; Packaging: Cut Tape (CT); Value: 4.7k, 1%
R178 R179 = Res_0402: Manufacturer Part Number 1: RMCF0402FT249R; Manufacturer: Stackpole Electronics Inc; Part Description: RES SMD 249 OHM 1% 1/16W 0402; Resistance (Ohms): 249; Power (Watts): 0.063W, 1/16W; Temperature Coefficient: ±100ppm/°C; Value: 249R, 1%; Supplier 1: Digi-Key; Supplier Part Number 1: RMCF0402FT249RCT-ND; Package / Case: 0402 (1005 Metric); Features: -; Size / Dimension: 0.039" L x 0.020" W (1.00mm x 0.50mm); Category: Resistors; Operating Temperature: -55°C ~ 155°C; Packaging: Cut Tape (CT); Tolerance: ±1%; Supplier Device Package: 0402; RoHS: RoHS Compliant; Composition: Thick Film; Number of Terminations: 2; Height: 0.016" (0.40mm)
R185 R187 R189 R191 = Res_0402: Manufacturer: Yageo; Manufacturer Part Number 1: RC0402FR-0715RL; Part Description: 15 Ohms ±1% 0.063W, 1/16W Chip Resistor 0402 (1005 Metric) Moisture Resistant Thick Film; Power Rating: 63mW; Voltage Rating: 50V; Temperature Coefficient: 100ppm/°C; Value: 15R, 1%; Supplier 1: Digi-Key; Supplier Part Number 1: 311-15LRCT-ND; Stock 1: 1902799; Pricing 1: 1=0.1, 10=0.016, 100=0.0067, 1000=0.00301, 2500=0.00261, 5000=0.00215 (USD); Case/Package: 0402; Case Code (Metric): 1005; Case Code (Imperial): 0402; Min Operating Temperature: -55°C; Max Operating Temperature: 155°C; Resistance: 15R; Tolerance: 1%; Packaging: Tape and Reel; Package Quantity: 1; Composition: Thick Film; Number of Terminations: 2; Termination: SMD/SMT; Military Standard: Not; Max Power Dissipation: 63mW; Features: Moisture Resistant; Length: 1mm; Height: 0.016inch; Width: 0.02inch; Depth: 0.5mm; REACH SVHC: Unknown; Lead Free: Lead Free; ComponentLink1URL: http://www.yageo.com/documents/recent/PYu-RC_Group_51_RoHS_L_9.pdf?src-supplier=Digi-Key; ComponentLink1Description: http://www.yageo.com/documents/recent/PYu-RC_Group_51_RoHS_L_9.pdf?src-supplier=Digi-Key; ComponentLink2URL: http://www.yageo.com/documents/recent/PYu-RC_Group_51_RoHS_L_10.pdf?src-supplier=Digi-Key; ComponentLink2Description: http://www.yageo.com/documents/recent/PYu-RC_Group_51_RoHS_L_10.pdf?src-supplier=Digi-Key; ComponentLink3URL: http://www.yageo.com/documents/recent/PYu-RC0402_51_RoHS_L_6_r.pdf?src-supplier=Future+Electronics; ComponentLink3Description: http://www.yageo.com/documents/recent/PYu-RC0402_51_RoHS_L_6_r.pdf?src-supplier=Future+Electronics; ComponentLink4URL: http://www.yageo.com/documents/recent/PYu-RC0402_51_RoHS_L_6_r.pdf?src-supplier=Mouser; ComponentLink4Description: http://www.yageo.com/documents/recent/PYu-RC0402_51_RoHS_L_6_r.pdf?src-supplier=Mouser
VT1 = NDS331N: Manufacturer Part Number: DMN6140L-13; Manufacturer: Diodes Incorporated; Part Description: N-Channel 60V 1.6A (Ta) 700mW (Ta) Surface Mount SOT-23; Power Dissipation (Max): 700mW (Ta); Vgs (Max): ±20V; Current - Continuous Drain (Id) @ 25°C: 1.6A (Ta); FET Type: N-Channel; Rds On (Max) @ Id, Vgs: 140 mOhm @ 1.8A, 10V; Vgs(th) (Max) @ Id: 3V @ 250µA; Drive Voltage (Max Rds On,  Min Rds On): 4.5V, 10V; FET Feature: -; Supplier Device Package: SOT-23; Supplier Part Number 1: DMN6140L-13DICT-ND; RoHS: RoHS Compliant; Technology: MOSFET (Metal Oxide); Package / Case: TO-236-3, SC-59, SOT-23-3; Mounting Type: Surface Mount; Packaging: Cut Tape (CT); Category: Discrete Semiconductor Products; Supplier 1: Digi-Key; Operating Temperature: -55°C ~ 150°C (TJ); Part Status: Active; Value: DMN6140L; Manufacturer Part Number 1: DMN6140L-13

## Sheet 20_FPGA_Power.SchDoc: FPGA power
size A3; Organization: Lime Microsystems; Address1: Surrey Tech Centre; Address2: Guildford GU2 7YG; Address3: Surrey; Address4: United Kingdom; Revision: 1.2; SheetNumber: 20; SheetTotal: 31
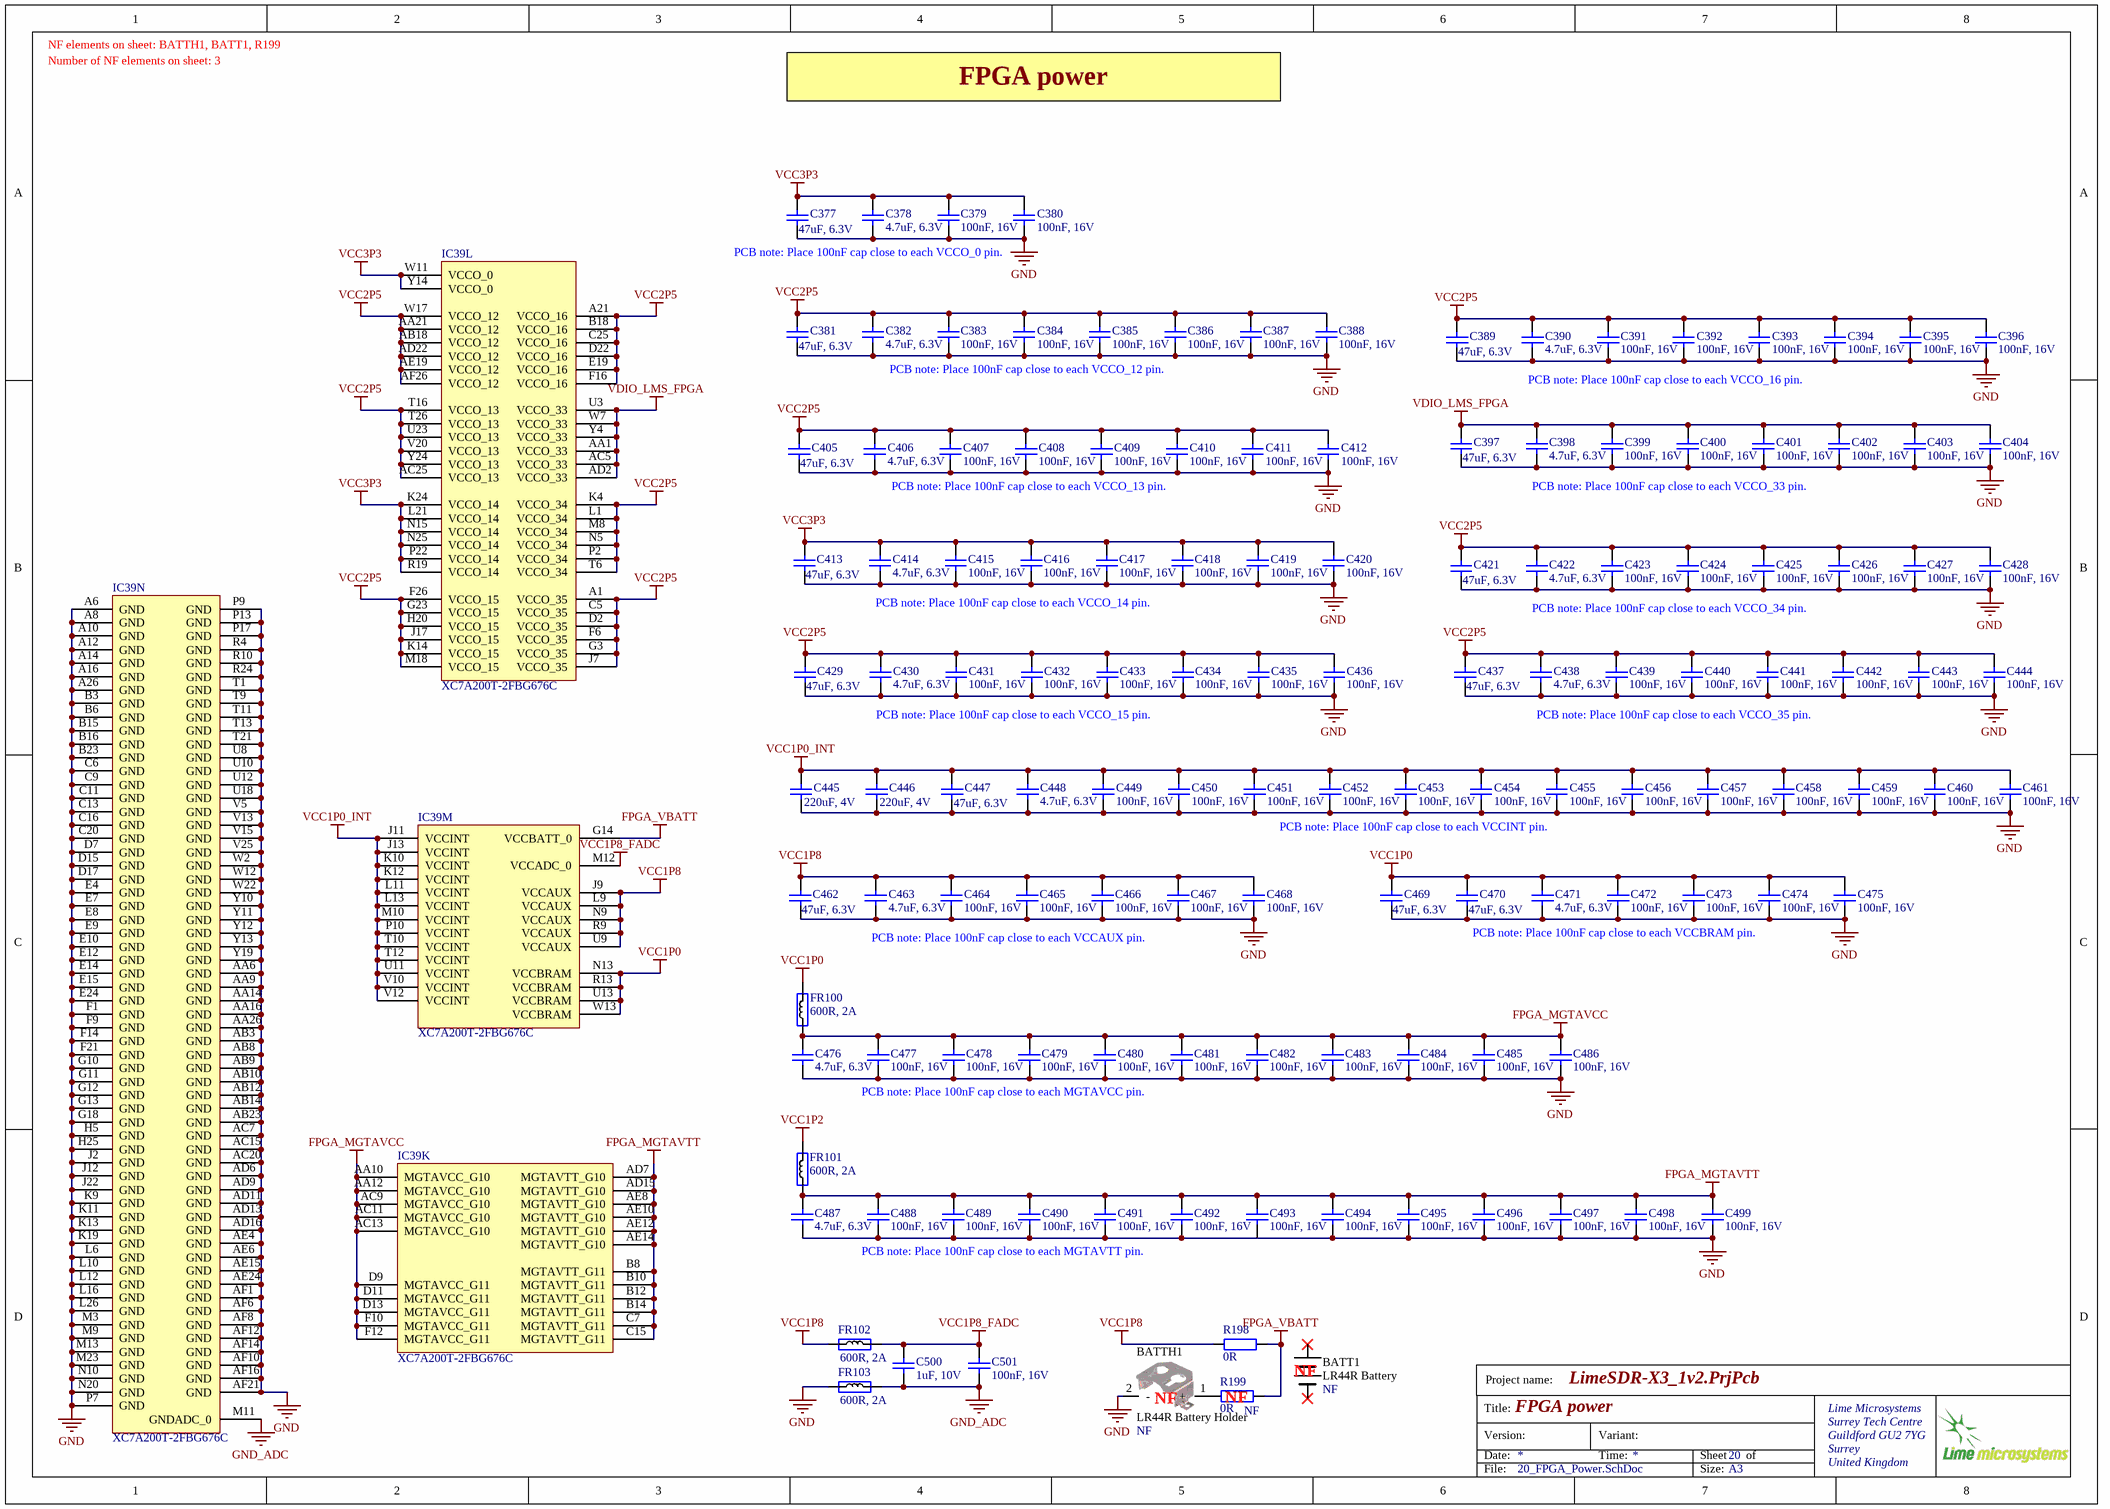
[diagram p19: 20_FPGA_Power.SchDoc]

### Parts
BATT1  LR44R Battery  Assembly Info: NF  (mechanical)
BATTH1  LR44R Battery Holder  Assembly Info: NF  [LR44R_BATTERY_HOLDER]
C377  47uF, 6.3V  [CAP1206]
C378  4.7uF, 6.3V  [CAP0402]
C379  100nF, 16V  [CAP0402]
C380  100nF, 16V  [CAP0402]
C381  47uF, 6.3V  [CAP1206]
C382  4.7uF, 6.3V  [CAP0402]
C383  100nF, 16V  [CAP0402]
C384  100nF, 16V  [CAP0402]
C385  100nF, 16V  [CAP0402]
C386  100nF, 16V  [CAP0402]
C387  100nF, 16V  [CAP0402]
C388  100nF, 16V  [CAP0402]
C389  47uF, 6.3V  [CAP1206]
C390  4.7uF, 6.3V  [CAP0402]
C391  100nF, 16V  [CAP0402]
C392  100nF, 16V  [CAP0402]
C393  100nF, 16V  [CAP0402]
C394  100nF, 16V  [CAP0402]
C395  100nF, 16V  [CAP0402]
C396  100nF, 16V  [CAP0402]
C397  47uF, 6.3V  [CAP1206]
C398  4.7uF, 6.3V  [CAP0402]
C399  100nF, 16V  [CAP0402]
C400  100nF, 16V  [CAP0402]
C401  100nF, 16V  [CAP0402]
C402  100nF, 16V  [CAP0402]
C403  100nF, 16V  [CAP0402]
C404  100nF, 16V  [CAP0402]
C405  47uF, 6.3V  [CAP1206]
C406  4.7uF, 6.3V  [CAP0402]
C407  100nF, 16V  [CAP0402]
C408  100nF, 16V  [CAP0402]
C409  100nF, 16V  [CAP0402]
C410  100nF, 16V  [CAP0402]
C411  100nF, 16V  [CAP0402]
C412  100nF, 16V  [CAP0402]
C413  47uF, 6.3V  [CAP1206]
C414  4.7uF, 6.3V  [CAP0402]
C415  100nF, 16V  [CAP0402]
C416  100nF, 16V  [CAP0402]
C417  100nF, 16V  [CAP0402]
C418  100nF, 16V  [CAP0402]
C419  100nF, 16V  [CAP0402]
C420  100nF, 16V  [CAP0402]
C421  47uF, 6.3V  [CAP1206]
C422  4.7uF, 6.3V  [CAP0402]
C423  100nF, 16V  [CAP0402]
C424  100nF, 16V  [CAP0402]
C425  100nF, 16V  [CAP0402]
C426  100nF, 16V  [CAP0402]
C427  100nF, 16V  [CAP0402]
C428  100nF, 16V  [CAP0402]
C429  47uF, 6.3V  [CAP1206]
C430  4.7uF, 6.3V  [CAP0402]
C431  100nF, 16V  [CAP0402]
C432  100nF, 16V  [CAP0402]
C433  100nF, 16V  [CAP0402]
C434  100nF, 16V  [CAP0402]
C435  100nF, 16V  [CAP0402]
C436  100nF, 16V  [CAP0402]
C437  47uF, 6.3V  [CAP1206]
C438  4.7uF, 6.3V  [CAP0402]
C439  100nF, 16V  [CAP0402]
C440  100nF, 16V  [CAP0402]
C441  100nF, 16V  [CAP0402]
C442  100nF, 16V  [CAP0402]
C443  100nF, 16V  [CAP0402]
C444  100nF, 16V  [CAP0402]
C445  220uF, 4V  [CAP1206]
C446  220uF, 4V  [CAP1206]
C447  47uF, 6.3V  [CAP1206]
C448  4.7uF, 6.3V  [CAP0402]
C449  100nF, 16V  [CAP0402]
C450  100nF, 16V  [CAP0402]
C451  100nF, 16V  [CAP0402]
C452  100nF, 16V  [CAP0402]
C453  100nF, 16V  [CAP0402]
C454  100nF, 16V  [CAP0402]
C455  100nF, 16V  [CAP0402]
C456  100nF, 16V  [CAP0402]
C457  100nF, 16V  [CAP0402]
C458  100nF, 16V  [CAP0402]
C459  100nF, 16V  [CAP0402]
C460  100nF, 16V  [CAP0402]
C461  100nF, 16V  [CAP0402]
C462  47uF, 6.3V  [CAP1206]
C463  4.7uF, 6.3V  [CAP0402]
C464  100nF, 16V  [CAP0402]
C465  100nF, 16V  [CAP0402]
C466  100nF, 16V  [CAP0402]
C467  100nF, 16V  [CAP0402]
C468  100nF, 16V  [CAP0402]
C469  47uF, 6.3V  [CAP1206]
C470  47uF, 6.3V  [CAP1206]
C471  4.7uF, 6.3V  [CAP0402]
C472  100nF, 16V  [CAP0402]
C473  100nF, 16V  [CAP0402]
C474  100nF, 16V  [CAP0402]
C475  100nF, 16V  [CAP0402]
C476  4.7uF, 6.3V  [CAP0402]
C477  100nF, 16V  [CAP0402]
C478  100nF, 16V  [CAP0402]
C479  100nF, 16V  [CAP0402]
C480  100nF, 16V  [CAP0402]
C481  100nF, 16V  [CAP0402]
C482  100nF, 16V  [CAP0402]
C483  100nF, 16V  [CAP0402]
C484  100nF, 16V  [CAP0402]
C485  100nF, 16V  [CAP0402]
C486  100nF, 16V  [CAP0402]
C487  4.7uF, 6.3V  [CAP0402]
C488  100nF, 16V  [CAP0402]
C489  100nF, 16V  [CAP0402]
C490  100nF, 16V  [CAP0402]
C491  100nF, 16V  [CAP0402]
C492  100nF, 16V  [CAP0402]
C493  100nF, 16V  [CAP0402]
C494  100nF, 16V  [CAP0402]
C495  100nF, 16V  [CAP0402]
C496  100nF, 16V  [CAP0402]
C497  100nF, 16V  [CAP0402]
C498  100nF, 16V  [CAP0402]
C499  100nF, 16V  [CAP0402]
C500  1uF, 10V  [CAP0402]
C501  100nF, 16V  [CAP0402]
FR100  600R, 2A  [RES0805]
FR101  600R, 2A  [RES0805]
FR102  600R, 2A  [RES0805]
FR103  600R, 2A  [RES0805]
IC39  XC7A200T-2FBG676C  [XC7A200T-2FBG676C_FBG676]  (parts K,L,M,N of 14)
R198  0R  [RES0402]
R199  0R  Assembly Info: NF  [RES0402]

### Nets
FPGA_MGTAVCC: C476.2 C477.1 C478.1 C479.1 C480.1 C481.1 C482.1 C483.1 C484.1 C485.1 C486.1 FR100.1 IC39.AA10(MGTAVCC_G10) IC39.AA12(MGTAVCC_G10) IC39.AC9(MGTAVCC_G10) IC39.AC11(MGTAVCC_G10) IC39.AC13(MGTAVCC_G10) IC39.D9(MGTAVCC_G11) IC39.D11(MGTAVCC_G11) IC39.D13(MGTAVCC_G11) IC39.F10(MGTAVCC_G11) IC39.F12(MGTAVCC_G11)
FPGA_MGTAVTT: C487.2 C488.1 C489.1 C490.1 C491.1 C492.1 C493.1 C494.1 C495.1 C496.1 C497.1 C498.1 C499.1 FR101.1 IC39.AD7(MGTAVTT_G10) IC39.AD15(MGTAVTT_G10) IC39.AE8(MGTAVTT_G10) IC39.AE10(MGTAVTT_G10) IC39.AE12(MGTAVTT_G10) IC39.AE14(MGTAVTT_G10) IC39.B8(MGTAVTT_G11) IC39.B10(MGTAVTT_G11) IC39.B12(MGTAVTT_G11) IC39.B14(MGTAVTT_G11) IC39.C7(MGTAVTT_G11) IC39.C15(MGTAVTT_G11)
FPGA_VBATT: IC39.G14(VCCBATT_0) R198.2 R199.2
GND: BATTH1.2(-) C377.1 C378.1 C379.2 C380.2 C381.1 C382.1 C383.2 C384.2 C385.2 C386.2 C387.2 C388.2 C389.1 C390.1 C391.2 C392.2 C393.2 C394.2 C395.2 C396.2 C397.1 C398.1 C399.2 C400.2 C401.2 C402.2 C403.2 C404.2 C405.1 C406.1 C407.2 C408.2 C409.2 C410.2 C411.2 C412.2 C413.1 C414.1 C415.2 C416.2 C417.2 C418.2 C419.2 C420.2 C421.1 C422.1 C423.2 C424.2 C425.2 C426.2 C427.2 C428.2 C429.1 C430.1 C431.2 C432.2 C433.2 C434.2 C435.2 C436.2 C437.1 C438.1 C439.2 C440.2 C441.2 C442.2 C443.2 C444.2 C445.1 C446.1 C447.1 C448.1 C449.2 C450.2 C451.2 C452.2 C453.2 C454.2 C455.2 C456.2 C457.2 C458.2 C459.2 C460.2 C461.2 C462.1 C463.1 C464.2 C465.2 C466.2 C467.2 C468.2 C469.1 C470.1 C471.1 C472.2 C473.2 C474.2 C475.2 C476.1 C477.2 C478.2 C479.2 C480.2 C481.2 C482.2 C483.2 C484.2 C485.2 C486.2 C487.1 C488.2 C489.2 C490.2 C491.2 C492.2 C493.2 C494.2 C495.2 C496.2 C497.2 C498.2 C499.2 FR103.1 IC39.A6(GND) IC39.A8(GND) IC39.A10(GND) IC39.A12(GND) IC39.A14(GND) IC39.A16(GND) IC39.A26(GND) IC39.AA6(GND) IC39.AA9(GND) IC39.AA14(GND) IC39.AA16(GND) IC39.AA26(GND) IC39.AB3(GND) IC39.AB8(GND) IC39.AB9(GND) IC39.AB10(GND) IC39.AB12(GND) IC39.AB14(GND) IC39.AB23(GND) IC39.AC7(GND) IC39.AC15(GND) IC39.AC20(GND) IC39.AD6(GND) IC39.AD9(GND) IC39.AD11(GND) IC39.AD13(GND) IC39.AD16(GND) IC39.AE4(GND) IC39.AE6(GND) IC39.AE15(GND) IC39.AE24(GND) IC39.AF1(GND) IC39.AF6(GND) IC39.AF8(GND) IC39.AF10(GND) IC39.AF12(GND) IC39.AF14(GND) IC39.AF16(GND) IC39.AF21(GND) IC39.B3(GND) IC39.B6(GND) IC39.B15(GND) IC39.B16(GND) IC39.B23(GND) IC39.C6(GND) IC39.C9(GND) IC39.C11(GND) IC39.C13(GND) IC39.C16(GND) IC39.C20(GND) IC39.D7(GND) IC39.D15(GND) IC39.D17(GND) IC39.E4(GND) IC39.E7(GND) IC39.E8(GND) IC39.E9(GND) IC39.E10(GND) IC39.E12(GND) IC39.E14(GND) IC39.E15(GND) IC39.E24(GND) IC39.F1(GND) IC39.F9(GND) IC39.F14(GND) IC39.F21(GND) IC39.G10(GND) IC39.G11(GND) IC39.G12(GND) IC39.G13(GND) IC39.G18(GND) IC39.H5(GND) IC39.H25(GND) IC39.J2(GND) IC39.J12(GND) IC39.J22(GND) IC39.K9(GND) IC39.K11(GND) IC39.K13(GND) IC39.K19(GND) IC39.L6(GND) IC39.L10(GND) IC39.L12(GND) IC39.L16(GND) IC39.L26(GND) IC39.M3(GND) IC39.M9(GND) IC39.M13(GND) IC39.M23(GND) IC39.N10(GND) IC39.N20(GND) IC39.P7(GND) IC39.P9(GND) IC39.P13(GND) IC39.P17(GND) IC39.R4(GND) IC39.R10(GND) IC39.R24(GND) IC39.T1(GND) IC39.T9(GND) IC39.T11(GND) IC39.T13(GND) IC39.T21(GND) IC39.U8(GND) IC39.U10(GND) IC39.U12(GND) IC39.U18(GND) IC39.V5(GND) IC39.V13(GND) IC39.V15(GND) IC39.V25(GND) IC39.W2(GND) IC39.W12(GND) IC39.W22(GND) IC39.Y10(GND) IC39.Y11(GND) IC39.Y12(GND) IC39.Y13(GND) IC39.Y19(GND)
GND_ADC: C500.1 C501.2 FR103.2 IC39.M11(GNDADC_0)
VCC1P0: C469.2 C470.2 C471.2 C472.1 C473.1 C474.1 C475.1 FR100.2 IC39.N13(VCCBRAM) IC39.R13(VCCBRAM) IC39.U13(VCCBRAM) IC39.W13(VCCBRAM)
VCC1P0_INT: C445.2 C446.2 C447.2 C448.2 C449.1 C450.1 C451.1 C452.1 C453.1 C454.1 C455.1 C456.1 C457.1 C458.1 C459.1 C460.1 C461.1 IC39.J11(VCCINT) IC39.J13(VCCINT) IC39.K10(VCCINT) IC39.K12(VCCINT) IC39.L11(VCCINT) IC39.L13(VCCINT) IC39.M10(VCCINT) IC39.P10(VCCINT) IC39.T10(VCCINT) IC39.T12(VCCINT) IC39.U11(VCCINT) IC39.V10(VCCINT) IC39.V12(VCCINT)
VCC1P2: FR101.2
VCC1P8: C462.2 C463.2 C464.1 C465.1 C466.1 C467.1 C468.1 FR102.1 IC39.J9(VCCAUX) IC39.L9(VCCAUX) IC39.N9(VCCAUX) IC39.R9(VCCAUX) IC39.U9(VCCAUX) R198.1
VCC1P8_FADC: C500.2 C501.1 FR102.2 IC39.M12(VCCADC_0)
VCC2P5: C381.2 C382.2 C383.1 C384.1 C385.1 C386.1 C387.1 C388.1 C389.2 C390.2 C391.1 C392.1 C393.1 C394.1 C395.1 C396.1 C405.2 C406.2 C407.1 C408.1 C409.1 C410.1 C411.1 C412.1 C421.2 C422.2 C423.1 C424.1 C425.1 C426.1 C427.1 C428.1 C429.2 C430.2 C431.1 C432.1 C433.1 C434.1 C435.1 C436.1 C437.2 C438.2 C439.1 C440.1 C441.1 C442.1 C443.1 C444.1 IC39.A1(VCCO_35) IC39.A21(VCCO_16) IC39.AA21(VCCO_12) IC39.AB18(VCCO_12) IC39.AC25(VCCO_13) IC39.AD22(VCCO_12) IC39.AE19(VCCO_12) IC39.AF26(VCCO_12) IC39.B18(VCCO_16) IC39.C5(VCCO_35) IC39.C25(VCCO_16) IC39.D2(VCCO_35) IC39.D22(VCCO_16) IC39.E19(VCCO_16) IC39.F6(VCCO_35) IC39.F16(VCCO_16) IC39.F26(VCCO_15) IC39.G3(VCCO_35) IC39.G23(VCCO_15) IC39.H20(VCCO_15) IC39.J7(VCCO_35) IC39.J17(VCCO_15) IC39.K4(VCCO_34) IC39.K14(VCCO_15) IC39.L1(VCCO_34) IC39.M8(VCCO_34) IC39.M18(VCCO_15) IC39.N5(VCCO_34) IC39.P2(VCCO_34) IC39.T6(VCCO_34) IC39.T16(VCCO_13) IC39.T26(VCCO_13) IC39.U23(VCCO_13) IC39.V20(VCCO_13) IC39.W17(VCCO_12) IC39.Y24(VCCO_13)
VCC3P3: C377.2 C378.2 C379.1 C380.1 C413.2 C414.2 C415.1 C416.1 C417.1 C418.1 C419.1 C420.1 IC39.K24(VCCO_14) IC39.L21(VCCO_14) IC39.N15(VCCO_14) IC39.N25(VCCO_14) IC39.P22(VCCO_14) IC39.R19(VCCO_14) IC39.W11(VCCO_0) IC39.Y14(VCCO_0)
VDIO_LMS_FPGA: C397.2 C398.2 C399.1 C400.1 C401.1 C402.1 C403.1 C404.1 IC39.AA1(VCCO_33) IC39.AC5(VCCO_33) IC39.AD2(VCCO_33) IC39.U3(VCCO_33) IC39.W7(VCCO_33) IC39.Y4(VCCO_33)
NetBATTH1_1: BATTH1.1(+) R199.1

Not connected (* = marked no-connect by the designer): BATT1 NEGATIVE* POSITIVE*

### Notes on the sheet
- NF elements on sheet: BATTH1, BATT1, R199
- Number of NF elements on sheet: 3
- FPGA power
- PCB note: Place 100nF cap close to each VCCO_0 pin.
- PCB note: Place 100nF cap close to each VCCO_12 pin.
- PCB note: Place 100nF cap close to each VCCO_16 pin.
- PCB note: Place 100nF cap close to each VCCO_13 pin.
- PCB note: Place 100nF cap close to each VCCO_33 pin.
- PCB note: Place 100nF cap close to each VCCO_14 pin.
- PCB note: Place 100nF cap close to each VCCO_34 pin.
- PCB note: Place 100nF cap close to each VCCO_15 pin.
- PCB note: Place 100nF cap close to each VCCO_35 pin.
- PCB note: Place 100nF cap close to each VCCINT pin.
- PCB note: Place 100nF cap close to each VCCAUX pin.
- PCB note: Place 100nF cap close to each VCCBRAM pin.
- PCB note: Place 100nF cap close to each MGTAVCC pin.
- PCB note: Place 100nF cap close to each MGTAVTT pin.
- (near BATT1) NF
- (near BATTH1) NF
- (near R199) NF
- Project name:
- Title:
- Version:
- Date:
- Variant:
- Time:
- Sheet
- of
- File:
- Size:
- A3

### Library data of the parts
BATT1 = LR44R_BATTERY: Part Description: Coin, 11.6mm Alkaline Manganese Dioxide 1.5 V Battery Non-Rechargeable (Primary); Manufacturer: Murata; ComponentLink1URL: http://na.industrial.panasonic.com/sites/default/pidsa/files/crseries_datasheets_merged.pdf; ComponentLink1Description: http://na.industrial.panasonic.com/sites/default/pidsa/files/crseries_datasheets_merged.pdf; Supplier 1: DigiKey; Supplier Part Number 1: 490-LR44R-ND; Manufacturer Part Number 1: LR44R; Stock 1: 1754; Pricing 1: 1=0,71000, 10=0,59200, 50=0,51660, 100=0,48880, 250=0,45272, 500=0,42774, 1000=0,40274, 2500=0,37496, 5000=0,35552 (USD)
BATTH1 = LR44R_BATTERY_HOLDER: Part Description: Battery Retainer Coin, 11.6mm 1 Cell SMD (SMT) Tab; Manufacturer: Keystone Electronics; Manufacturer Part Number 1: 2996; Number of Batteries: 1; ComponentLink1URL: http://na.industrial.panasonic.com/sites/default/pidsa/files/crseries_datasheets_merged.pdf; ComponentLink1Description: http://na.industrial.panasonic.com/sites/default/pidsa/files/crseries_datasheets_merged.pdf; Supplier 1: Digi-Key; Supplier Part Number 1: 36-2996-ND; Stock 1: 11716; Pricing 1: 1=0,39000, 25=0,32720, 100=0,27070, 250=0,24944, 500=0,23438, 1000=0,21935, 2500=0,19929, 5000=0,18550 (USD); RoHS: Yes; Mount: Surface Mount,PCB; Case/Package: SMD/SMT; Color: Silver; Contact Material: Bronze; Contact Plating: Tin; Package Quantity: 100; Termination: SMD/SMT; Series: -; Number of Cells: 1; REACH SVHC: No SVHC; Lead Free: Lead Free; ComponentLink2URL: https://datasheet.ciiva.com/18491/2996-18491290.pdf?src-supplier=Digi-Key; ComponentLink2Description: https://datasheet.ciiva.com/18491/2996-18491290.pdf?src-supplier=Digi-Key
C377 C381 C389 C397 C405 C413 C421 C429 C437 C447 C462 C469 C470 = Cap_1206: Manufacturer: Samsung Electro-Mechanics; Manufacturer Part Number: CL31A476MQHNNNE; Part Description: 47µF ±20% 6.3V Ceramic Capacitor X5R 1206 (3216 Metric); Notification: Current market demand for these product types have resulted in fluctuating and extending lead times. Lead times may differ.; Temperature Coefficient: X5R; Tolerance: ±20%; Thickness (Max): 0.071" (1.80mm); Height - Seated (Max): -; Operating Temperature: -55°C ~ 85°C; Lead Style: -; Package / Case: 1206 (3216 Metric); Size / Dimension: 0.126" L x 0.063" W (3.20mm x 1.60mm); Applications: General Purpose; Ratings: -; Mounting Type: Surface Mount, MLCC; Voltage - Rated: 6.3V; Lead Spacing: -; Features: -; Supplier Part Number 1: 1276-1167-1-ND; RoHS: RoHS Compliant; Category: Capacitors; Supplier 1: Digi-Key; Packaging: Cut Tape (CT); Part Status: Active; Value: 47uF, 6.3V; Manufacturer Part Number 1: CL31A476MQHNNNE
C378 C382 C390 C398 C406 C414 C422 C430 C438 C448 C463 C471 C476 C487 = Cap_0402: Manufacturer: Murata Electronics North America; Part Description: 4.7µF ±20% 6.3V X5R Ceramic Capacitor -55°C ~ 85°C Surface Mount, MLCC 0402 (1005 Metric) 0.039" L x 0.020" W (1.00mm x 0.50mm); Manufacturer Part Number 1: GRM155R60J475ME87D; Tolerance: ±20%; Capacitance: 4.7µF; Temperature Coefficient: X5R; Lead Style: -; Ratings: -; Height - Seated (Max): -; Thickness (Max): 0.022" (0.55mm); Voltage - Rated: 6.3V; Packaging: Cut Tape (CT); Lead Spacing: -; Category: Capacitors; Supplier Part Number 1: 490-5408-1-ND; Applications: General Purpose; Operating Temperature: -55°C ~ 85°C; Mounting Type: Surface Mount, MLCC; Features: Derating Recommended; RoHS: RoHS Compliant; Supplier 1: Digi-Key; Package / Case: 0402 (1005 Metric); Size / Dimension: 0.039" L x 0.020" W (1.00mm x 0.50mm); Value: 4.7uF, 6.3V
C379 C380 C383-C388 C391-C396 C399-C404 C407-C412 C415-C420 C423-C428 C431-C436 C439-C444 C449-C461 C464-C468 C472-C475 C477-C486 C488-C499 C501 = Cap_0402: Manufacturer: Murata Electronics; Manufacturer Part Number 1: GRM155R71C104KA88D; Part Description: 0.10µF ±10% 16V X7R Ceramic Capacitor -55°C ~ 125°C Surface Mount, MLCC 0402 (1005 Metric) 0.039" L x 0.020" W (1.00mm x 0.50mm); Tolerance: 10 %; Type: General Purpose MLCC; Capacitance: 0.1 uF; Case Length: 1 mm; Dielectric: X7R; Case Height: 0.5 mm; Temperature Coefficient / Code: +/- 15 %; Value: 100nF, 16V; Supplier 1: Mouser; Supplier Part Number 1: 81-GRM155R71C104KA88; Case Code - in: 0402; RoHS: RoHS Compliant; Operating Temperature Range: - 55 C to + 125 C; Series: GRM; Termination Style: SMD/SMT; Package / Case: 0402 (1005 metric); Voltage Rating DC: 16 V; Maximum Operating Temperature: + 125 C; Case Code - mm: 1005; Minimum Operating Temperature: - 55 C; Product Category: Low & Medium Capacitance SMD Ceramic Chip Capacitors; Packaging: Reel; Product: General Type MLCCs; Category: Multilayer Ceramic Capacitors MLCC - SMD/SMT; Brand: Murata Electronics; Case Width: 0.5 mm; RoHS - Mouser: Y; Standard Pack Qty: 10000; Minimum Order Quantity: 1; Reeling: True
C445 C446 = Cap_1206: Manufacturer Part Number 1: GRM31CR60G227ME11L; Manufacturer: Murata Electronics North America; Part Description: 220µF ±20% 4V Ceramic Capacitor X5R 1206 (3216 Metric); Capacitance: 220µF; Temperature Coefficient: X5R; Tolerance: ±20%; Package / Case: 1206 (3216 Metric); Supplier 1: Digi-Key; Packaging: Cut Tape (CT); Size / Dimension: 0.126" L x 0.063" W (3.20mm x 1.60mm); Operating Temperature: -55°C ~ 85°C; Voltage - Rated: 4V; Mounting Type: Surface Mount, MLCC; Ratings: -; Supplier Part Number 1: 490-9774-1-ND; Category: Capacitors; Lead Spacing: -; Lead Style: -; Applications: General Purpose; Features: -; Height - Seated (Max): -; Thickness (Max): 0.075" (1.90mm); RoHS: RoHS Compliant; Value: 220uF, 4V
C500 = Cap_0402: Manufacturer Part Number 1: C1005X5R1E105K050BC; Manufacturer: TDK; Part Description: 1µF ±10% 10V X5R Ceramic Capacitor -55°C ~ 85°C Surface Mount, MLCC 0402 (1005 Metric) 0.039" L x 0.020" W (1.00mm x 0.50mm); Voltage Rating: 10; Capacitance Tolerance: ± 10%; Product Range: TDK - C Series; Ceramic Capacitor Case: 0402 [1005 Metric]; Capacitance: 1; Dielectric Characteristic: X6; Value: 1uF, 10V; Supplier 1: Digi-Key; Supplier Part Number 1: 445-9066-1-ND; MSL: -; RoHS: YES
FR100-FR103 = Ferrite: Manufacturer Part Number 1: MPZ2012S601AT000; Manufacturer: TDK Corporation; Part Description: FERRITE BEAD 600 OHM 0805 1LN; Filter Type: Differential Mode - Single; Impedance @ Frequency: 600 Ohm @ 100MHz; DC Resistance (DCR): 100 mOhm Max; Supplier 1: Digi-Key; Supplier Part Number 1: 445-2206-2-ND; Mounting Type: Surface Mount; RoHS: RoHS Compliant; Height (Max): 0.041" (1.05mm); Packaging: Tape & Reel (TR); Category: Filters; Current Rating: 2A; Package / Case: 0805 (2012 Metric); Size / Dimension: 0.079" L x 0.049" W (2.00mm x 1.25mm); Value: 600R, 2A
IC39 = XC7A200T-2FBG676C: as IC39 on sheet 19_FPGA_misc; ComponentLink1Description: Manufacturer URL; ComponentLink1URL: http://www.xilinx.com/; ComponentLink2Description: Datasheet; ComponentLink2URL: http://www.xilinx.com/support/documentation/data_sheets/ds180_7Series_Overview.pdf; ComponentLink3Description: Package Specification; ComponentLink3URL: http://www.xilinx.com/support/documentation/user_guides/ug475_7Series_Pkg_Pinout.pdf; ComponentLink4Description: DC and Switching Characteristics; ComponentLink4URL: http://www.xilinx.com/support/documentation/data_sheets/ds181_Artix_7_Data_Sheet.pdf; ComponentLink5Description: Package File; ComponentLink5URL: http://www.xilinx.com/support/packagefiles/a7packages/xc7a200tfbg676pkg.txt; ComponentLink6Description: Packaging and Pinout; ComponentLink6URL: http://www.xilinx.com/support/documentation/user_guides/ug475_7Series_Pkg_Pinout.pdf; Supplier 1: Digi-Key; Supplier Part Number 1: 122-1865-ND; Manufacturer Part Number 1: XC7A200T-2FBG676C; Stock 1: 124; Pricing 1: 1=261,30000 (USD); RoHS: Yes; Case/Package: FCBGA; Number of Pins: 676; Contact Plating: Copper,Tin,Silver; Min Operating Temperature: 0°C; Max Operating Temperature: 85°C; ComponentLink7URL: https://datasheet.ciiva.com/15066/ds181-artix-7-data-sheet-15066344.pdf?src-supplier=Digi-Key; ComponentLink7Description: https://datasheet.ciiva.com/15066/ds181-artix-7-data-sheet-15066344.pdf?src-supplier=Digi-Key; ComponentLink8URL: https://datasheet.ciiva.com/48475/ds180-7series-overview-48475947.pdf?src-supplier=Avnet; ComponentLink8Description: https://datasheet.ciiva.com/48475/ds180-7series-overview-48475947.pdf?src-supplier=Avnet
R198 R199 = Res_0402: as R168-R173 on sheet 19_FPGA_misc; Value: 0R; Supplier 1: Digi-Key; Supplier Part Number 1: 311-0.0JRTR-ND; Category: Resistors; Temperature Coefficient: -; Features: Moisture Resistant; Supplier Device Package: 0402; Height: 0.016" (0.40mm); Package / Case: 0402 (1005 Metric); Operating Temperature: -55°C ~ 155°C; Size / Dimension: 0.039" L x 0.020" W (1.00mm x 0.50mm); Composition: Thick Film; Packaging: Tape & Reel (TR); Number of Terminations: 2; RoHS: RoHS Compliant